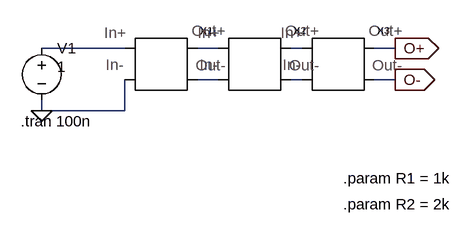
[diagram p0: schematic Test_model.asc]
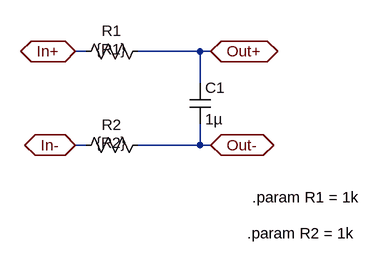
[diagram p1: sub-circuit test_motif.asc]
Test_model.asc, the LTspice schematic file:
Version 4
SHEET 1 880 680
WIRE 160 112 32 112
WIRE 304 112 272 112
WIRE 432 112 416 112
WIRE 576 112 544 112
WIRE 304 160 272 160
WIRE 432 160 416 160
WIRE 576 160 544 160
WIRE 32 208 32 192
WIRE 160 208 160 160
WIRE 160 208 32 208
FLAG 576 112 O+
IOPIN 576 112 Out
FLAG 576 160 O-
IOPIN 576 160 Out
FLAG 32 208 0
SYMBOL Test_motif 224 144 R0
SYMATTR InstName X1
SYMBOL Test_motif 368 144 R0
SYMATTR InstName X2
SYMBOL Test_motif 496 144 R0
SYMATTR InstName X3
SYMBOL voltage 32 96 R0
WINDOW 3 24 44 Left 2
WINDOW 123 0 0 Left 0
WINDOW 39 0 0 Left 0
SYMATTR Value 1
SYMATTR InstName V1
TEXT 0 224 Left 2 !.tran 100n
TEXT 496 312 Left 2 !.param R1 = 1k
TEXT 496 352 Left 2 !.param R2 = 2k

test_motif.asc, the sub-circuit schematic file:
Version 4
SHEET 1 880 680
WIRE 112 112 96 112
WIRE 288 112 192 112
WIRE 304 112 288 112
WIRE 288 160 288 112
WIRE 112 256 96 256
WIRE 288 256 288 224
WIRE 288 256 192 256
WIRE 304 256 288 256
FLAG 96 112 In+
IOPIN 96 112 BiDir
FLAG 96 256 In-
IOPIN 96 256 BiDir
FLAG 304 112 Out+
IOPIN 304 112 BiDir
FLAG 304 256 Out-
IOPIN 304 256 BiDir
SYMBOL res 208 96 R90
WINDOW 0 0 56 VBottom 2
WINDOW 3 28 56 VBottom 2
SYMATTR InstName R1
SYMATTR Value {R1}
SYMBOL cap 272 160 R0
SYMATTR InstName C1
SYMATTR Value 1µ
SYMBOL res 208 240 R90
WINDOW 0 0 56 VBottom 2
WINDOW 3 28 56 VBottom 2
SYMATTR InstName R2
SYMATTR Value {R2}
TEXT 368 336 Left 2 !.param R1 = 1k
TEXT 360 392 Left 2 !.param R2 = 1k

The netlist it stands for:
* Test_model.asc
XX1 N001 0 N002 N004 test_motif
XX2 N002 N004 N003 N005 test_motif
XX3 N003 N005 O+ O- test_motif
V1 N001 0 1

* block symbol definitions
.subckt test_motif In+ In- Out+ Out-
R1 Out+ In+ {R1}
C1 Out+ Out- 1µ
R2 Out- In- {R2}
.param R1 = 1k
.param R2 = 1k
.ends test_motif

.tran 100n
.param R1 = 1k
.param R2 = 2k
.backanno
.end